# EAGLE design PCB_HYDRA_V1.1 (EAGLE 8.4.0)

## Sheet 1 of 2
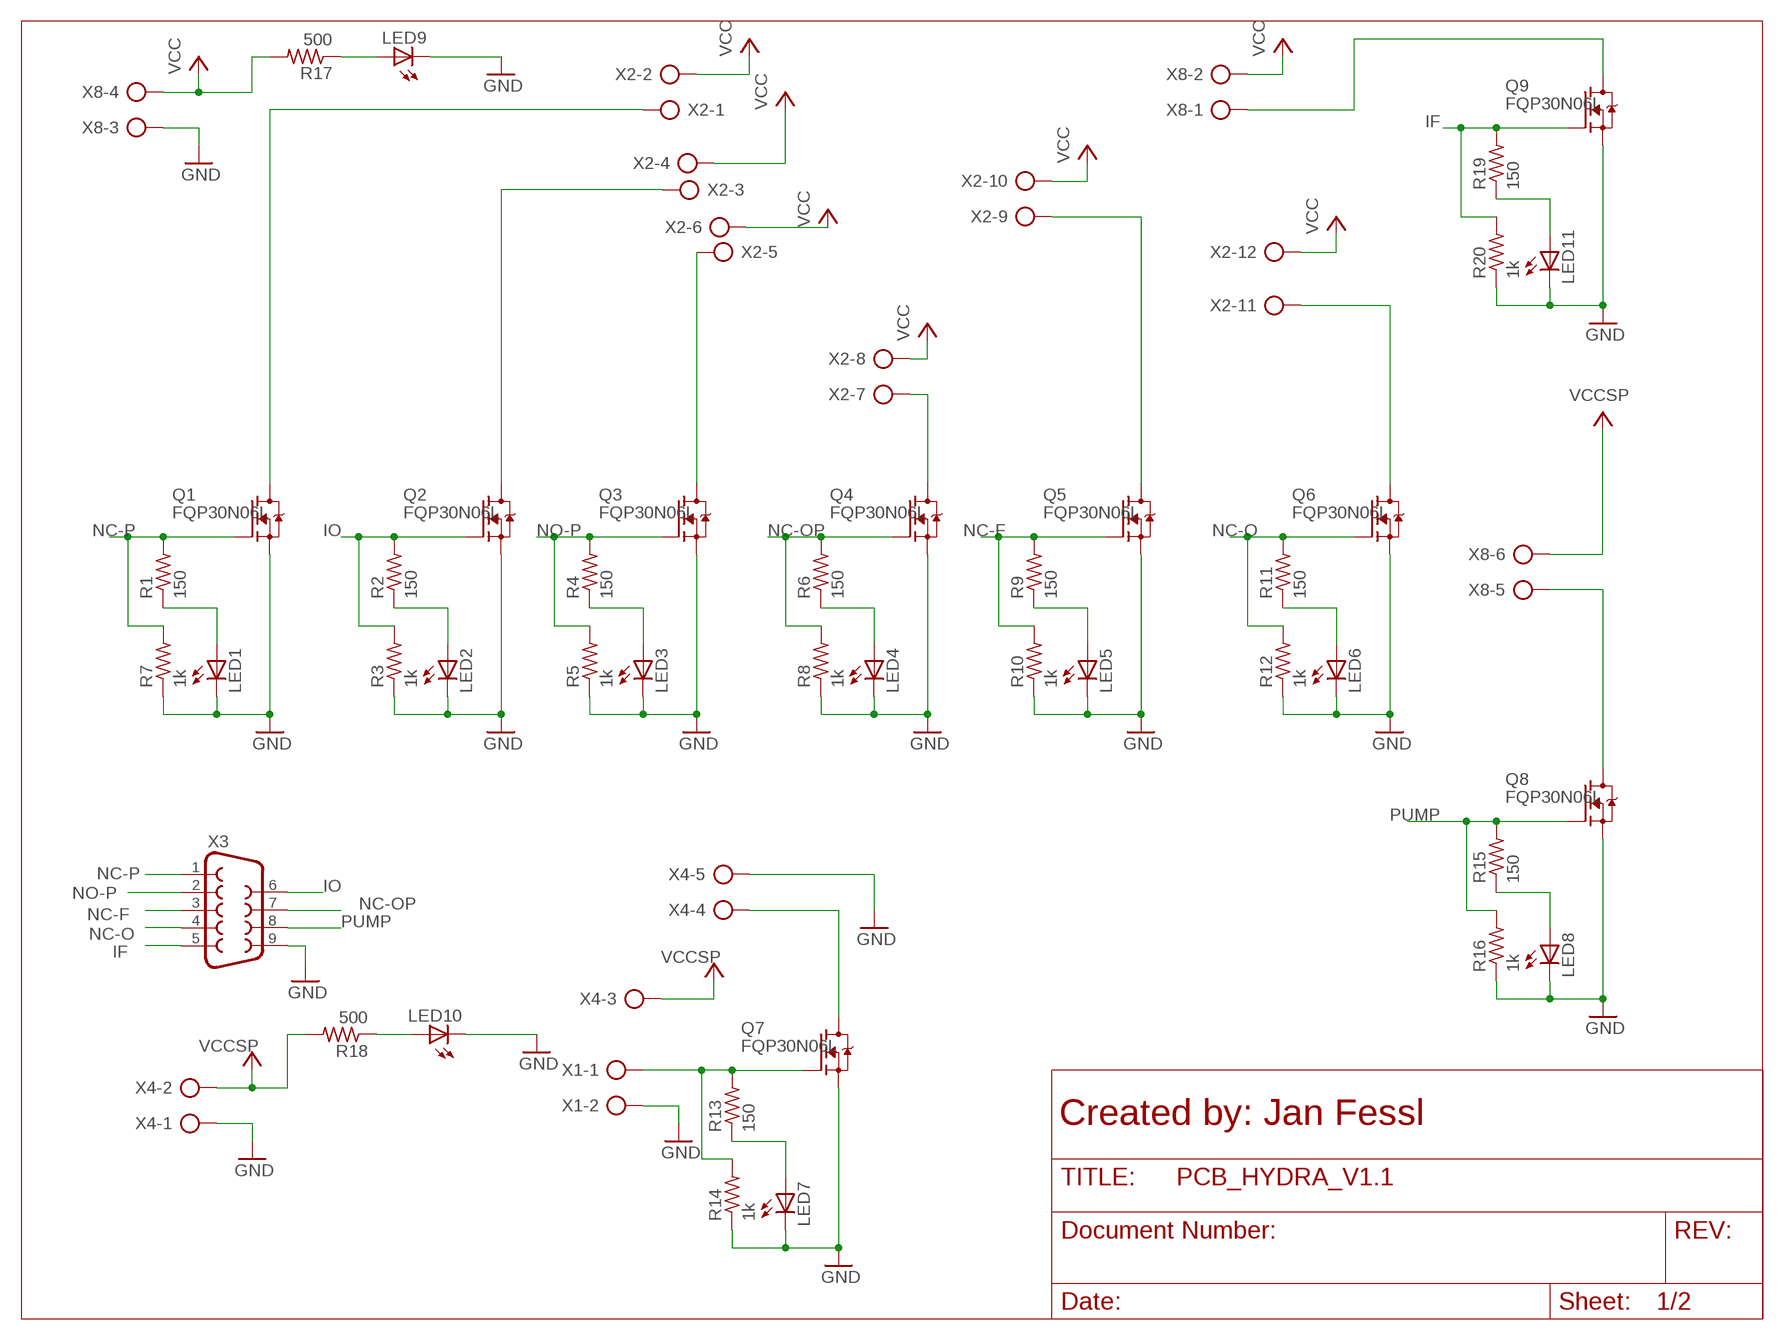
[diagram p0: schematic, sheet 1]
FRAME1 (LETTER_L): AUTHOR: Created by: Jan Fessl

### Parts
LED1  LEDCHIPLED_0805  [CHIPLED_0805]
LED2  LEDCHIPLED_0805  [CHIPLED_0805]
LED3  LEDCHIPLED_0805  [CHIPLED_0805]
LED4  LEDCHIPLED_0805  [CHIPLED_0805]
LED5  LEDCHIPLED_0805  [CHIPLED_0805]
LED6  LEDCHIPLED_0805  [CHIPLED_0805]
LED7  LEDCHIPLED_0805  [CHIPLED_0805]
LED8  LEDCHIPLED_0805  [CHIPLED_0805]
LED9  LEDCHIPLED_0805  [CHIPLED_0805]
LED10  LEDCHIPLED_0805  [CHIPLED_0805]
LED11  LEDCHIPLED_0805  [CHIPLED_0805]
Q1  FQP30N06L  [TO220V]
Q2  FQP30N06L  [TO220V]
Q3  FQP30N06L  [TO220V]
Q4  FQP30N06L  [TO220V]
Q5  FQP30N06L  [TO220V]
Q6  FQP30N06L  [TO220V]
Q7  FQP30N06L  [TO220V]
Q8  FQP30N06L  [TO220V]
Q9  FQP30N06L  [TO220V]
R1  150  R-US_M1206  [M1206]
R2  150  R-US_M1206  [M1206]
R3  1k  R-US_M1206  [M1206]
R4  150  R-US_M1206  [M1206]
R5  1k  R-US_M1206  [M1206]
R6  150  R-US_M1206  [M1206]
R7  1k  R-US_M1206  [M1206]
R8  1k  R-US_M1206  [M1206]
R9  150  R-US_M1206  [M1206]
R10  1k  R-US_M1206  [M1206]
R11  150  R-US_M1206  [M1206]
R12  1k  R-US_M1206  [M1206]
R13  150  R-US_M1206  [M1206]
R14  1k  R-US_M1206  [M1206]
R15  150  R-US_M1206  [M1206]
R16  1k  R-US_M1206  [M1206]
R17  500  R-US_M1206  [M1206]
R18  500  R-US_M1206  [M1206]
R19  150  R-US_M1206  [M1206]
R20  1k  R-US_M1206  [M1206]
X1  AK300/2  [AK300/2]
X2  AK300/12  [AK300/12]
X3  F09H  [F09H]
X4  AK300/5  [AK300/5]
X8  AK300/6  [AK300/6]

### Nets
GND: LED1.C LED2.C LED3.C LED4.C LED5.C LED6.C LED7.C LED8.C LED9.C LED10.C LED11.C Q1.3(S) Q2.3(S) Q3.3(S) Q4.3(S) Q5.3(S) Q6.3(S) Q7.3(S) Q8.3(S) Q9.3(S) R3.1 R5.1 R7.1 R8.1 R10.1 R12.1 R14.1 R16.1 R20.1 X1.2 X3.9 X4.1 X4.5 X8.3 ; also sheet 2
IF: Q9.1(G) R19.2 R20.2 X3.5
IO: Q2.1(G) R2.2 R3.2 X3.6
N$1: Q1.2(D) X2.1
N$2: Q2.2(D) X2.3
N$3: Q3.2(D) X2.5
N$4: Q4.2(D) X2.7
N$5: Q5.2(D) X2.9
N$6: Q6.2(D) X2.11
N$7: LED7.A R13.1
N$8: LED1.A R1.1
N$9: LED8.A R15.1
N$10: LED2.A R2.1
N$11: Q7.2(D) X4.4
N$12: LED3.A R4.1
N$14: LED4.A R6.1
N$15: Q8.2(D) X8.5
N$16: LED5.A R9.1
N$17: LED9.A R17.1
N$18: LED6.A R11.1
N$19: LED10.A R18.1
N$20: LED11.A R19.1
N$21: Q9.2(D) X8.1
NC-F: Q5.1(G) R9.2 R10.2 X3.3
NC-O: Q6.1(G) R11.2 R12.2 X3.4
NC-OP: Q4.1(G) R6.2 R8.2 X3.7
NC-P: Q1.1(G) R1.2 R7.2 X3.1
NO-P: Q3.1(G) R4.2 R5.2 X3.2
PUMP: Q8.1(G) R15.2 R16.2 X3.8
SIGNAL: Q7.1(G) R13.2 R14.2 X1.1
VCC: R17.2 X2.2 X2.4 X2.6 X2.8 X2.10 X2.12 X8.2 X8.4
VCCSP: R18.2 X4.2 X4.3 X8.6 ; supply symbol labelled VCC

## Sheet 2 of 2
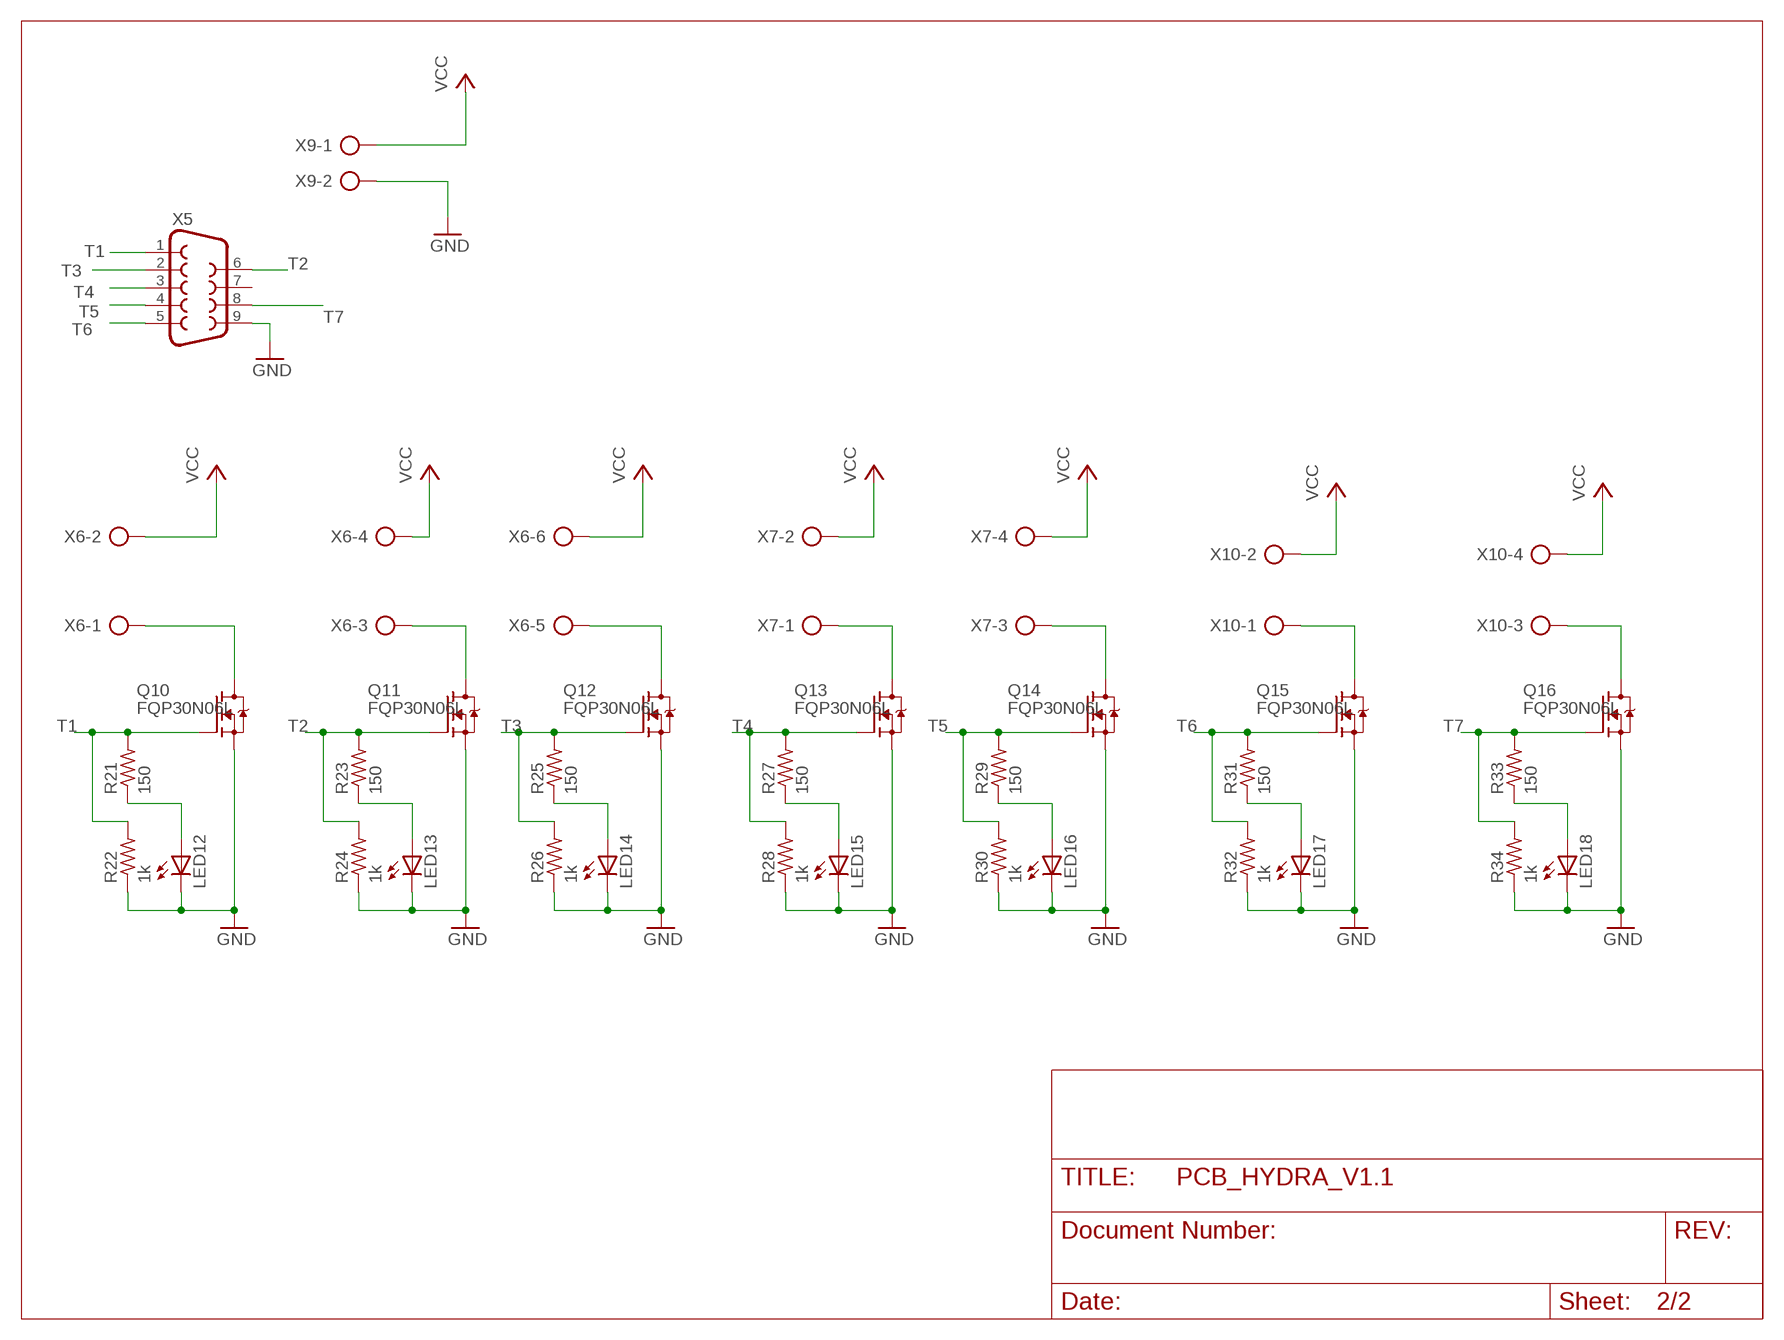
[diagram p1: schematic, sheet 2]

### Parts
LED12  LEDCHIPLED_0805  [CHIPLED_0805]
LED13  LEDCHIPLED_0805  [CHIPLED_0805]
LED14  LEDCHIPLED_0805  [CHIPLED_0805]
LED15  LEDCHIPLED_0805  [CHIPLED_0805]
LED16  LEDCHIPLED_0805  [CHIPLED_0805]
LED17  LEDCHIPLED_0805  [CHIPLED_0805]
LED18  LEDCHIPLED_0805  [CHIPLED_0805]
Q10  FQP30N06L  [TO220V]
Q11  FQP30N06L  [TO220V]
Q12  FQP30N06L  [TO220V]
Q13  FQP30N06L  [TO220V]
Q14  FQP30N06L  [TO220V]
Q15  FQP30N06L  [TO220V]
Q16  FQP30N06L  [TO220V]
R21  150  R-US_M1206  [M1206]
R22  1k  R-US_M1206  [M1206]
R23  150  R-US_M1206  [M1206]
R24  1k  R-US_M1206  [M1206]
R25  150  R-US_M1206  [M1206]
R26  1k  R-US_M1206  [M1206]
R27  150  R-US_M1206  [M1206]
R28  1k  R-US_M1206  [M1206]
R29  150  R-US_M1206  [M1206]
R30  1k  R-US_M1206  [M1206]
R31  150  R-US_M1206  [M1206]
R32  1k  R-US_M1206  [M1206]
R33  150  R-US_M1206  [M1206]
R34  1k  R-US_M1206  [M1206]
X5  F09H  [F09H]
X6  AK300/6  [AK300/6]
X7  AK300/4  [AK300/4]
X9  AK300/2  [AK300/2]
X10  AK300/4  [AK300/4]

### Nets
GND: LED12.C LED13.C LED14.C LED15.C LED16.C LED17.C LED18.C Q10.3(S) Q11.3(S) Q12.3(S) Q13.3(S) Q14.3(S) Q15.3(S) Q16.3(S) R22.1 R24.1 R26.1 R28.1 R30.1 R32.1 R34.1 X5.9 X9.2 ; also sheet 1
N$13: LED12.A R21.1
N$22: LED13.A R23.1
N$23: LED14.A R25.1
N$24: LED15.A R27.1
N$25: LED16.A R29.1
N$26: LED17.A R31.1
N$27: LED18.A R33.1
N$28: Q10.2(D) X6.1
N$29: Q11.2(D) X6.3
N$30: Q12.2(D) X6.5
N$31: Q13.2(D) X7.1
N$32: Q15.2(D) X10.1
N$33: Q14.2(D) X7.3
N$34: Q16.2(D) X10.3
T1: Q10.1(G) R21.2 R22.2 X5.1
T2: Q11.1(G) R23.2 R24.2 X5.6
T3: Q12.1(G) R25.2 R26.2 X5.2
T4: Q13.1(G) R27.2 R28.2 X5.3
T5: Q14.1(G) R29.2 R30.2 X5.4
T6: Q15.1(G) R31.2 R32.2 X5.5
T7: Q16.1(G) R33.2 R34.2 X5.8
VCCS: X6.2 X6.4 X6.6 X7.2 X7.4 X9.1 X10.2 X10.4 ; supply symbol labelled VCC
Unconnected: X5.7

## Library data of the parts
LED1-LED18 = led:LED: LED OSRAM: - CHIPLED LG R971, LG N971, LY N971, LG Q971, LY Q971, LO R971, LY R971 LH N974, LH R974 LS Q976, LO Q976, LY Q976 LO Q996 - Hyper CHIPLED LW Q18S LB Q993, LB Q99A, LB R99A - SideLED LS A670, LO A670, LY A670, LG A670, LP A670 LB A673, LV A673, LT A673, LW A673 LH A674 LY A675 LS A676, LA A676, LO A676, LY A676, LW A676 LS A679, LY A679, LG A679 - Hyper Micro SIDELED® LS Y876, LA Y876, LO Y876, LY Y876 LT Y87S - SmartLED LW L88C, LW L88S LB L89C, LB L89S, LG L890 LS L89K, LO L89K, LY L89K LS L896, LA L896, LO L896, LY L896 - TOPLED LS T670, LO T670, LY T670, LG T670, LP T670 LSG T670, LSP T670, LSY T670, LOP T670, LYG T670 LG T671, LOG T671, LSG T671 LB T673, LV T673, LT T673, LW T673 LH T674 LS T676, LA T676, LO T676, LY T676, LB T676, LH T676, LSB T676, LW T676 LB T67C, LV T67C, LT T67C, LS T67K, LO T67K, LY T67K, LW E67C LS E67B, LA E67B, LO E67B, LY E67B, LB E67C, LV E67C, LT E67C LW T67C LS T679, LY T679, LG T679 LS T770, LO T770, LY T770, LG T770, LP T770 LB T773, LV T773, LT T773, LW T773 LH T774 LS E675, LA E675, LY E675, LS T675 LS T776, LA T776, LO T776, LY T776, LB T776 LHGB T686 LT T68C, LB T68C - Hyper Mini TOPLED® LB M676 - Mini TOPLED Santana® LG M470 LS M47K, LO M47K, LY M47K Source: http://www.osram.convergy.de LUXEON: - LUMILED® LXK2-PW12-R00, LXK2-PW12-S00, LXK2-PW14-U00, LXK2-PW14-V00 LXK2-PM12-R00, LXK2-PM12-S00, LXK2-PM14-U00 LXK2-PE12-Q00, LXK2-PE12-R00, LXK2-PE12-S00, LXK2-PE14-T00, LXK2-PE14-U00 LXK2-PB12-K00, LXK2-PB12-L00, LXK2-PB12-M00, LXK2-PB14-N00, LXK2-PB14-P00, LXK2-PB14-Q00 LXK2-PR12-L00, LXK2-PR12-M00, LXK2-PR14-Q00, LXK2-PR14-R00 LXK2-PD12-Q00, LXK2-PD12-R00, LXK2-PD12-S00 LXK2-PH12-R00, LXK2-PH12-S00 LXK2-PL12-P00, LXK2-PL12-Q00, LXK2-PL12-R00 Source: www.luxeon.com KINGBRIGHT: KA-3528ASYC Source: www.kingbright.com; OC_NEWARK: unknown
Q1 Q9 Q10 = FQP30N06L:FQP30N06L: N-Channel QFET® MOSFET Source: Data Sheet; AVAILABILITY: Good; DESCRIPTION: FQP30N06 Series 60 V 40 mOhm Flange Mount N-Channel MOSFET - TO-220; MF: Fairchild Semiconductor; MP: FQP30N06L; MPN: STP36NF06L; OC_NEWARK: unknown; PACKAGE: TO-220 Fairchild Semiconductor; PRICE: 0.72 USD
Q2-Q8 Q11-Q16 = FQP30N06L:FQP30N06L: N-Channel QFET® MOSFET Source: Data Sheet; AVAILABILITY: Good; DESCRIPTION: FQP30N06 Series 60 V 40 mOhm Flange Mount N-Channel MOSFET - TO-220; MF: Fairchild Semiconductor; MP: FQP30N06L; MPN: STP36NF06L; OC_NEWARK: 69K1304; PACKAGE: TO-220 Fairchild Semiconductor; PRICE: 0.72 USD
R1-R34 = rcl:R-US_: RESISTOR, American symbol; MPN: M2012ES1G01; OC_NEWARK: 10X5877
X1 X9 = con-ptr500:AK300/2: CONNECTOR; OC_FARNELL: unknown; OC_NEWARK: unknown
X2 = con-ptr500:AK300/12: CONNECTOR; OC_FARNELL: unknown; OC_NEWARK: unknown
X3 X5 = con-subd:F09: SUB-D; OC_FARNELL: unknown; OC_NEWARK: unknown
X4 = con-ptr500:AK300/5: CONNECTOR; OC_FARNELL: unknown; OC_NEWARK: unknown
X6 X8 = con-ptr500:AK300/6: CONNECTOR; OC_FARNELL: unknown; OC_NEWARK: unknown
X7 X10 = con-ptr500:AK300/4: CONNECTOR; OC_FARNELL: unknown; OC_NEWARK: unknown

## Board
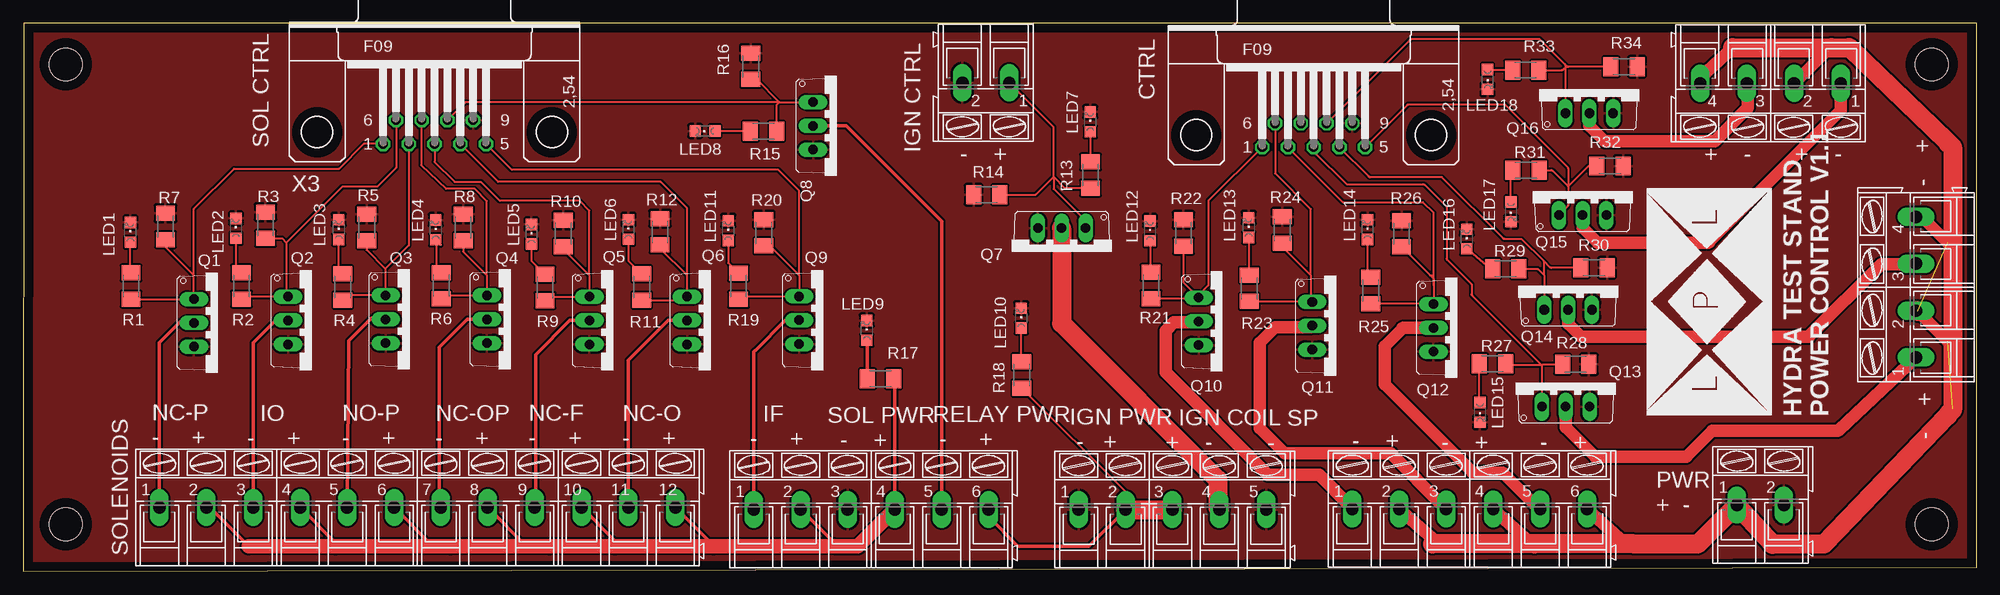
[diagram p2: board, top side]
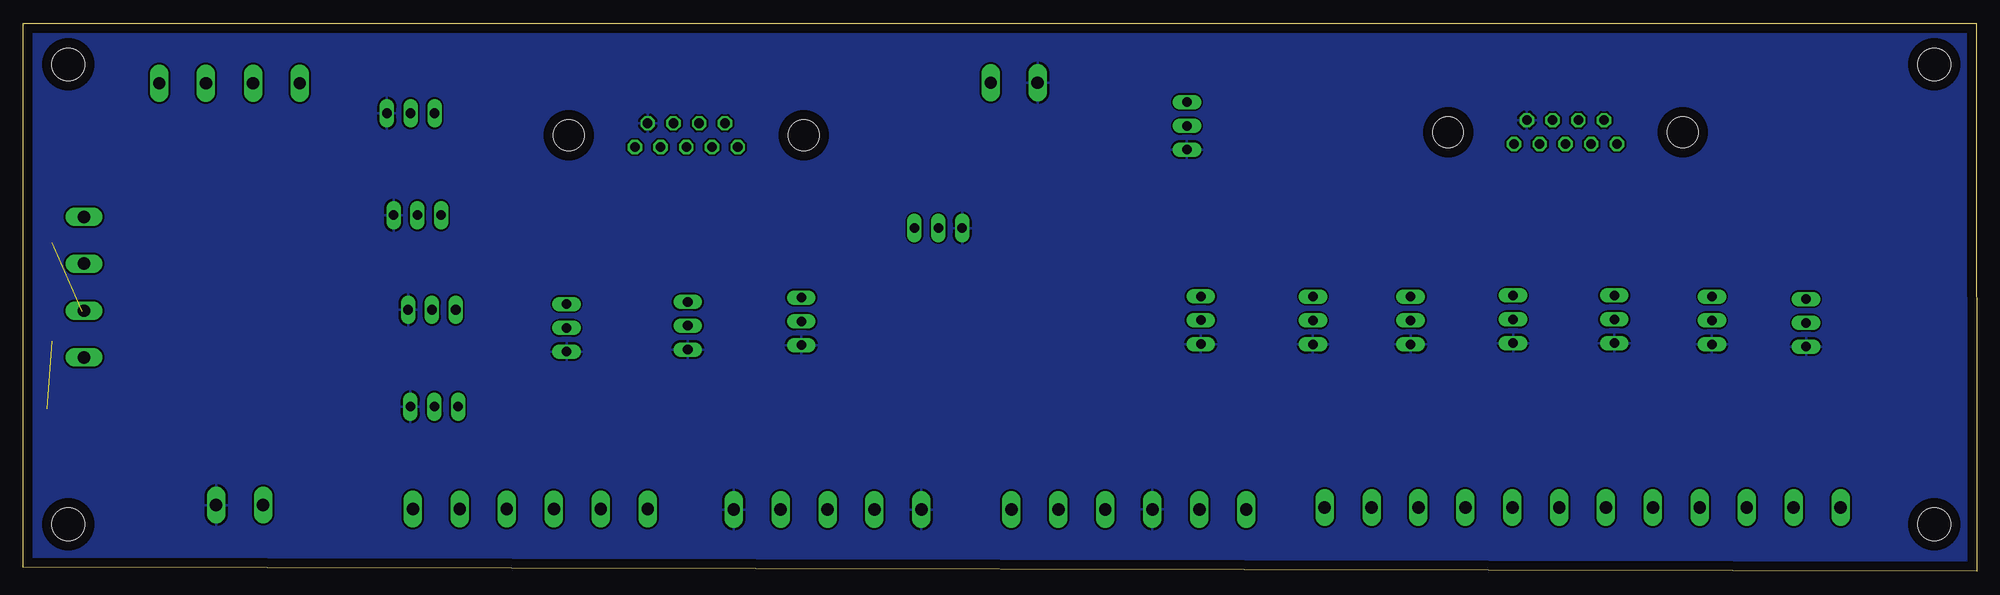
[diagram p3: board, bottom side, seen from below]

Size 208.28 x 58.42 mm. Coordinates in mm from the lower left corner, seen from the top.
Outline: 0,0 208.28,0.41 208.28,58.42 0.05,58.42 0,0
Copper layers (1*16): Top 0.035mm / dielectric 1.5mm / Bottom 0.035mm
Design rules "default *": minimum track width 6mil, minimum drill 0.35mm, track to track 8mil, track to pad 6mil, pad to pad 6mil, via to via 6mil, smd to smd 6mil, copper to edge 40mil, drill to drill 6mil, minimum pad ring 10mil, minimum via ring 8mil, stop-mask expansion 4mil, vias tented up to drill 0mil, thermal gap 10mil
Holes 3.51 mm at 4.52,5.03 4.52,54.05 203.5,5.03 203.5,54.05

### Footprints (pad centres in the part's own frame; a part is rotated, then mirrored left to right if it is on the bottom)
CHIPLED_0805 = smd 1.2 x 1.2: A 0,-1.05; C 0,1.05
TO220V = drill 1.016 long: 1 -2.54,-2.54; 2 0,-2.54; 3 2.54,-2.54
M1206 = smd 1.6 x 2: 1 -1.4,0; 2 1.4,0
AK300/2 = drill 1.321 long: 1 -2.515,0; 2 2.489,0
AK300/12 = drill 1.321 long: 1 -27.508,0; 2 -22.504,0; 3 -17.501,0; 4 -12.497,0; 5 -7.493,0; 6 -2.489,0; 7 2.489,0; 8 7.493,0; 9 12.497,0; 10 17.501,0; 11 22.504,0; 12 27.508,0
F09H = drill 1.016 octagon: 1 -5.486,-1.27; 2 -2.743,-1.27; 3 0,-1.27; 4 2.743,-1.27; 5 5.486,-1.27; 6 -4.115,1.27; 7 -1.372,1.27; 8 1.372,1.27; 9 4.115,1.27 | hole 3.302: -12.522,0; 12.522,0
AK300/5 = drill 1.321 long: 1 -10.008,0; 2 -5.004,0; 3 0,0; 4 5.004,0; 5 10.008,0
AK300/6 = drill 1.321 long: 1 -12.522,0; 2 -7.518,0; 3 -2.515,0; 4 2.515,0; 5 7.518,0; 6 12.522,0
AK300/4 = drill 1.321 long: 1 -7.493,0; 2 -2.515,0; 3 2.515,0; 4 7.493,0

### Placement (x,y rotation side)
LED1  11.4,36.14 0 top
LED2  22.66,36.58 0 top
LED3  33.63,36.42 0 top
LED4  43.97,36.4 0 top
LED5  54.18,35.94 0 top
LED6  64.52,36.45 0 top
LED7  113.77,47.93 0 top
LED8  72.69,46.94 90 top
LED9  89.94,25.68 0 top
LED10  106.4,27 0 top
LED11  75.16,36.32 0 top
LED12  120.14,36.3 0 top
LED13  130.66,36.65 0 top
LED14  143.33,36.42 0 top
LED15  155.32,16.94 180 top
LED16  153.92,35.43 0 top
LED17  158.62,38.33 180 top
LED18  156.13,52.45 180 top
Q1  20.73,26.49 270 top
Q2  30.76,26.75 270 top
Q3  41.17,26.87 270 top
Q4  51.97,26.87 270 top
Q5  62.89,26.75 270 top
Q6  73.3,26.75 270 top
Q7  110.72,34.06 180 top
Q8  86.74,47.5 270 top
Q9  85.27,26.77 270 top
Q10  127.86,26.64 270 top
Q11  139.98,26.19 270 top
Q12  152.91,25.96 270 top
Q13  164.47,20.09 0 top
Q14  164.72,30.43 0 top
Q15  166.27,40.51 0 top
Q16  166.98,51.38 0 top
R1  11.48,30.43 270 top
R2  23.27,30.43 270 top
R3  25.81,36.91 270 top
R4  34.06,30.3 270 top
R5  36.6,36.65 270 top
R6  44.55,30.45 270 top
R7  15.14,36.78 270 top
R8  46.89,36.65 270 top
R9  55.63,30.25 270 top
R10  57.56,36.02 270 top
R11  65.94,30.3 270 top
R12  67.89,36.2 270 top
R13  113.79,42.27 270 top
R14  102.72,40.16 0 top
R15  78.92,46.91 0 top
R16  77.57,53.85 270 top
R17  91.39,20.52 0 top
R18  106.45,20.93 270 top
R19  76.25,30.4 270 top
R20  78.94,36.09 270 top
R21  120.24,30.48 270 top
R22  123.7,36.07 270 top
R23  130.71,30.18 270 top
R24  134.24,36.4 270 top
R25  143.69,29.95 270 top
R26  146.96,35.99 270 top
R27  156.67,22.12 0 top
R28  165.53,22.07 180 top
R29  158.06,32.26 0 top
R30  167.49,32.36 180 top
R31  160.22,42.77 0 top
R32  169.19,43.21 180 top
R33  160.2,53.44 0 top
R34  170.69,53.8 180 top
X1  102.62,52.1 180 top
X2  42.01,6.81 0 top
X3  43.84,46.84 0 top
X4  122.53,6.58 0 top
X5  137.59,46.51 0 top
X6  154.23,6.63 0 top
X7  201.83,30.3 90 top
X8  90.4,6.6 0 top
X9  185.24,7.06 0 top
X10  186.31,52.04 180 top

### Tracks (layer width: path | path; a pad name or v marks a point on that pad's centre or on a via)
GND
  pour Top: 0,65.28 0,-7.01 179.5,-6.55 212.5,-7.37 212.32,63.93
  pour Bottom: -3.51,66.6 -3.51,-7.01 231.34,-7.01 231.34,66.6
IF
  Top 0.203: X3.5 52.09,42.8 80.52,42.8 82.73,40.59 82.73,31.55 | 82.73,31.55 Q9.1 76.56,29.31 R19.2 | R20.2 79.58,34.69 82.73,31.55
IO
  Top 0.152: 24.22,29.29 R2.2
  Top 0.203: 24.22,29.29 Q2.1 28.04,29.46 28.04,35.05 | X3.6 39.75,48.08 39.75,43.05 37.72,41.02 34.01,41.02 28.04,35.05 | R3.2 27.59,35.51 28.04,35.05
N$1
  Top 0.381: X2.1 14.5,24.36 16.74,26.59 18.09,26.59 Q1.2
N$2
  Top 0.381: X2.3 24.51,24.36 26.95,26.8 27,26.75 Q2.2
N$3
  Top 0.152: 37.11,27 38.51,27 Q3.2
  Top 0.381: X2.5 34.7,24.59 37.11,27
N$4
  Top 0.381: Q4.2 47.32,26.87 44.32,23.88 44.32,6.99 X2.7
N$5
  Top 0.381: Q5.2 58.24,26.75 54.61,23.11 54.61,6.91 X2.9
N$6
  Top 0.381: Q6.2 68.78,26.75 64.52,22.48 X2.11
N$7
  Top 0.203: R13.1 113.79,46.85 LED7.A
N$8
  Top 0.152: LED1.A 11.48,35.02 | R1.1 11.4,31.91
  Top 0.203: 11.4,31.91 LED1.A
N$9
  Top 0.152: 73.77,46.91 LED8.A
  Top 0.203: R15.1 73.77,46.91
N$10
  Top 0.203: LED2.A 22.66,32.44 R2.1
N$11
  Top 2.032: 127.53,7.01 X4.4 127.38,6.73 127.38,9.78 110.72,26.44 Q7.2
N$12
  Top 0.152: LED3.A 33.75,35.25
  Top 0.203: LED3.A 33.63,32.13 R4.1
N$13
  Top 0.203: LED12.A 120.14,31.98 R21.1
N$14
  Top 0.152: 44.55,34.76 44.06,35.25 LED4.A | R6.1 44.06,32.34
  Top 0.203: 44.06,32.34 44.06,35.25
N$15
  Top 0.381: Q8.2 87.76,47.5 97.92,37.34 X8.5
N$16
  Top 0.203: LED5.A 54.18,33.1 R9.1
N$17
  Top 0.381: R17.1 89.99,24.58 LED9.A
N$18
  Top 0.203: LED6.A 64.52,33.12 R11.1
N$19
  Top 0.203: R18.1 106.4,22.38 LED10.A
N$20
  Top 0.203: LED11.A 75.16,32.9 R19.1
N$21
  Top 0.381: Q9.2 81.25,26.77 78.07,23.58 | 78.07,23.58 77.98,23.5 | X8.1 77.88,23.39 78.07,23.58
N$22
  Top 0.203: R23.1 130.71,35.55 LED13.A
N$23
  Top 0.203: R25.1 143.33,31.7 LED14.A
N$24
  Top 0.203: LED15.A arc-45 155.27,18.12 R27.1
N$25
  Top 0.203: R29.1 156.53,32.26 arc-45 156.36,32.33 LED16.A
N$26
  Top 0.203: LED17.A 158.62,42.47 arc-45 158.7,42.65 R31.1
N$27
  Top 0.203: 156.43,53.44 arc45 LED18.A 158.65,53.5 arc-45 R33.1
N$28
  Top 1.346: Q10.2 125.22,26.54 122.68,26.54 121.79,25.65 121.79,21.21 132.72,10.29 138.18,10.29 141.45,7.01 X6.1
N$29
  Top 1.346: Q11.2 137.29,26.04 133.48,26.04 131.83,24.38 131.83,15.24 134.49,12.57 145.8,12.57 151.36,7.01 X6.3
N$30
  Top 1.346: Q12.2 147.22,25.96 arc45 147.04,25.88 145.16,24 145.16,20.04 arc45 145.24,19.86 154.51,10.59 arc45 154.69,10.52 157.73,10.52 161.16,7.08 arc45 161.34,7.01 X6.5
N$31
  Top 1.346: Q13.2 164.47,15.47 arc45 164.54,15.29 167.64,12.19 177.19,12.19 arc45 177.37,12.27 180.09,14.99 193.39,14.99 arc45 193.57,15.06 X7.1
N$32
  Top 1.346: Q15.2 166.27,36.78 arc45 166.34,36.6 167.89,35.05 179.6,35.05 arc45 179.78,35.13 193.8,49.15 X10.1
N$33
  Top 1.346: Q14.2 164.72,26.52 arc45 164.79,26.34 166.12,25.02 190.27,25.02 arc45 190.45,25.09 198.12,32.77 201.2,32.77 arc45 X7.3
N$34
  Top 1.346: Q16.2 166.98,47.63 arc45 167.05,47.45 168.66,45.85 180.24,45.85 arc45 180.41,45.92 183.9,49.4 183.9,51.84 arc45 183.82,52.02 X10.3
NC-F
  Top 0.152: 55.84,29.16 55.82,29.13 R9.2
  Top 0.203: 55.82,29.13 55.98,29.29 Q5.1 60.35,31.55 | X3.3 43.84,43.71 43.81,43.69 45.97,41.53 48.77,41.53 50.8,39.5 59.31,39.5 60.35,38.46 60.35,31.55 | R10.2 57.56,34.34 60.35,31.55
NC-O
  Top 0.152: 68.61,34.49 R12.2
  Top 0.203: X3.4 50.62,41.53 67.94,41.53 70.76,38.71 70.76,31.55 | 70.76,31.55 Q6.1 70.38,28.9 R11.2 | R12.2 67.89,34.42 70.76,31.55
NC-OP
  Top 0.152: 45.42,29.41 R6.2
  Top 0.203: 45.42,29.41 Q4.1 49.43,31.55 | X3.7 42.42,48.03 42.42,43.31 45.09,40.77 48.13,40.77 49.43,39.47 49.43,31.55 | R8.2 46.89,34.09 49.43,31.55
NC-P
  Top 0.152: Q1.1
  Top 0.203: R1.2 Q1.1 | X3.1 36.3,45.57 33.66,42.93 22.48,42.93 18.19,38.63 18.19,31.55 | Q1.1 18.19,31.55 | 18.19,31.55 15.14,34.59 R7.2
NO-P
  Top 0.152: 34.63,29.41 R4.2
  Top 0.203: 34.63,29.41 Q3.1 38.61,29.44 38.61,32.26 | X3.2 41.1,34.75 38.61,32.26 | R5.2 36.6,34.27 38.61,32.26
PUMP
  Top 0.152: 64.52,50.04 64.77,50.04 | R16.2 78.21,52.45 | 80.32,49.74 80.62,50.04
  Top 0.203: X3.8 47.14,50.04 64.52,50.04 80.62,50.04 | 80.62,50.04 Q8.1 | 78.21,52.45 80.62,50.04 | R15.2 80.32,49.74
SIGNAL
  Top 0.203: X1.1 109.86,47.37 109.86,42.06 | 109.86,42.06 109.86,40.77 113.26,37.36 Q7.1 | R14.2 107.95,40.16 109.86,42.06 | R13.2 111.05,40.87 109.86,42.06
T1
  Top 0.203: R21.2 125.22,29.08 Q10.1 | R22.2 123.7,30.81 Q10.1 | X5.1 126.36,39.5 126.36,30.48 125.32,29.44 Q10.1
  Top 0.381: 125.22,29.51 125.22,29.08
T2
  Top 0.203: 137.29,31.55 137.29,38.61 133.48,42.42 X5.6 | 137.29,31.55 137.29,28.88 Q11.1 130.76,28.73 R23.2 | R24.2 134.24,34.59 137.29,31.55
T3
  Top 0.203: X5.2 140.72,39.37 149.22,39.37 150.38,38.21 150.38,31.55 | 150.38,30.48 150.38,31.55 | 150.38,30.48 150.38,28.51 Q12.1 150.32,28.55 R25.2 | 150.01,31.55 150.38,31.55 | R26.2 150.38,31.18 150.38,30.48
T4
  Top 0.203: X5.3 137.59,44.88 arc45 137.67,44.71 141.1,41.27 149.25,41.27 arc-45 149.43,41.2 151.76,38.86 151.76,33.38 arc45 151.84,33.2 154.43,30.61 154.43,29.57 arc45 154.51,29.39 161.93,21.97 | 161.93,21.97 Q13.1 | 161.93,21.97 158.32,21.97 arc-45 158.15,22.05 R27.2 | 161.93,21.97 161.95,22 arc-45 162.13,22.07 R28.2
T5
  Top 0.203: 143.46,42.11 arc45 143.64,42.04 | 162.18,31.55 Q14.1 | 162.18,31.55 162.18,32.91 arc45 162.1,33.09 | 162.1,33.09 159.77,35.43 157.97,35.43 arc-45 157.79,35.51 151.26,42.04 143.64,42.04 | 143.64,42.04 arc-45 143.46,42.11 | 143.46,42.11 X5.4 | R29.2 161.36,32.26 arc-45 161.54,32.18 162.18,31.55 | R30.2 162.94,32.36 arc-45 162.76,32.43 162.1,33.09
T6
  Top 0.203: X5.5 147.55,49.71 | 147.55,49.71 arc-45 147.73,49.78 | 164.72,41.05 164.72,42.95 arc45 164.65,43.13 157.99,49.78 147.73,49.78 | R32.2 166.98,43.2 arc45 166.8,43.13 164.72,41.05 | R31.2 162.89,42.77 arc-45 163.07,42.7 164.72,41.05 | 147.55,49.71 arc-45 147.73,49.78 | 164.72,41.05 164.72,39.07 arc-45 164.65,38.89 Q15.1
T7
  Top 0.203: X5.8 147.88,56.7 arc-45 148.06,56.77 161.67,56.77 164.37,54.08 | 164.37,54.08 arc-45 164.44,53.9 Q16.1 | R34.2 164.75,53.8 arc-45 164.57,53.87 | 164.57,53.87 164.37,54.08 | R33.2 164.03,53.44 arc45 164.21,53.52 164.57,53.87
VCC
  Top 0.381: X2.2 19.86,6.81 24,2.67 | X2.4 33.27,3.05 33.27,2.67 | X2.6 43.66,2.67 45.57,2.67 | X2.8 53.65,2.67 56.08,2.67 | X2.10 63.09,3.23 63.09,2.67 | X2.12 73.61,2.72 73.61,2.67 | X8.2 86.61,2.87 86.61,2.67 | X8.4 92.91,20.4 R17.2
  Top 1.524: X8.4 88.98,2.67 86.61,2.67 73.61,2.67 63.09,2.67 56.08,2.67 45.57,2.67 33.27,2.67 24,2.67
VCCS  (2 unrouted)
  Top 1.346: X6.2 150.17,3.55 arc-45 150.24,3.38 150.24,2.92 | X6.4 160.76,3 arc45 160.94,2.92 161.16,2.92 | X6.6 170.77,3 arc45 170.95,2.92 171.75,2.92 | 202.03,27.71 205.23,24.51 | X7.4 202.38,37.8 arc-45 202.56,37.72 205.23,35.05 | X10.2 192.73,55.95 arc45 192.79,55.83 | X10.4 178.82,52.52 arc-45 178.89,52.7 182.27,55.83
  Top 2.032: 150.24,2.92 161.16,2.92 171.75,2.92 178.48,2.92 arc45 178.66,3 X9.1 186.54,2.87 arc45 186.47,2.92 192.02,2.92 205.16,16.56 arc45 205.23,16.74 205.67,17.18 arc45 205.74,17.36 205.74,45.11 arc45 205.67,45.29 205.16,45.79 | X7.2 201.85,27.79 arc-45 202.03,27.71 | 205.23,45.62 arc45 205.16,45.79 | 182.27,55.83 192.79,55.83 194.64,55.83 arc-45 194.82,55.76 205.16,45.79
VCCSP
  Top 0.203: R18.2 117.53,8.46 X4.2
  Top 0.381: X4.2 113.61,2.67 106.05,2.67 102.92,5.79 X8.6
  Top 2.032: X4.2 X4.3

### Text on the board
tPlace: CTRL | IGN CTRL | SOL CTRL | + - | + - | - + | - + | - + | NC-P / - + | IO / - + | NO-P / - + | NC-OP / - + | NC-F / - + | NC-O / - + | IF / - + | SOL PWR / - + | RELAY PWR / - + | IGN PWR / - + | IGN COIL / + - | SP / - | - + | - + | - + | PWR / + - | SOLENOIDS
tNames: HYDRA TEST STAND / POWER CONTROL V1.1